# EAGLE schematic lowerboard (EAGLE 9.5.2)
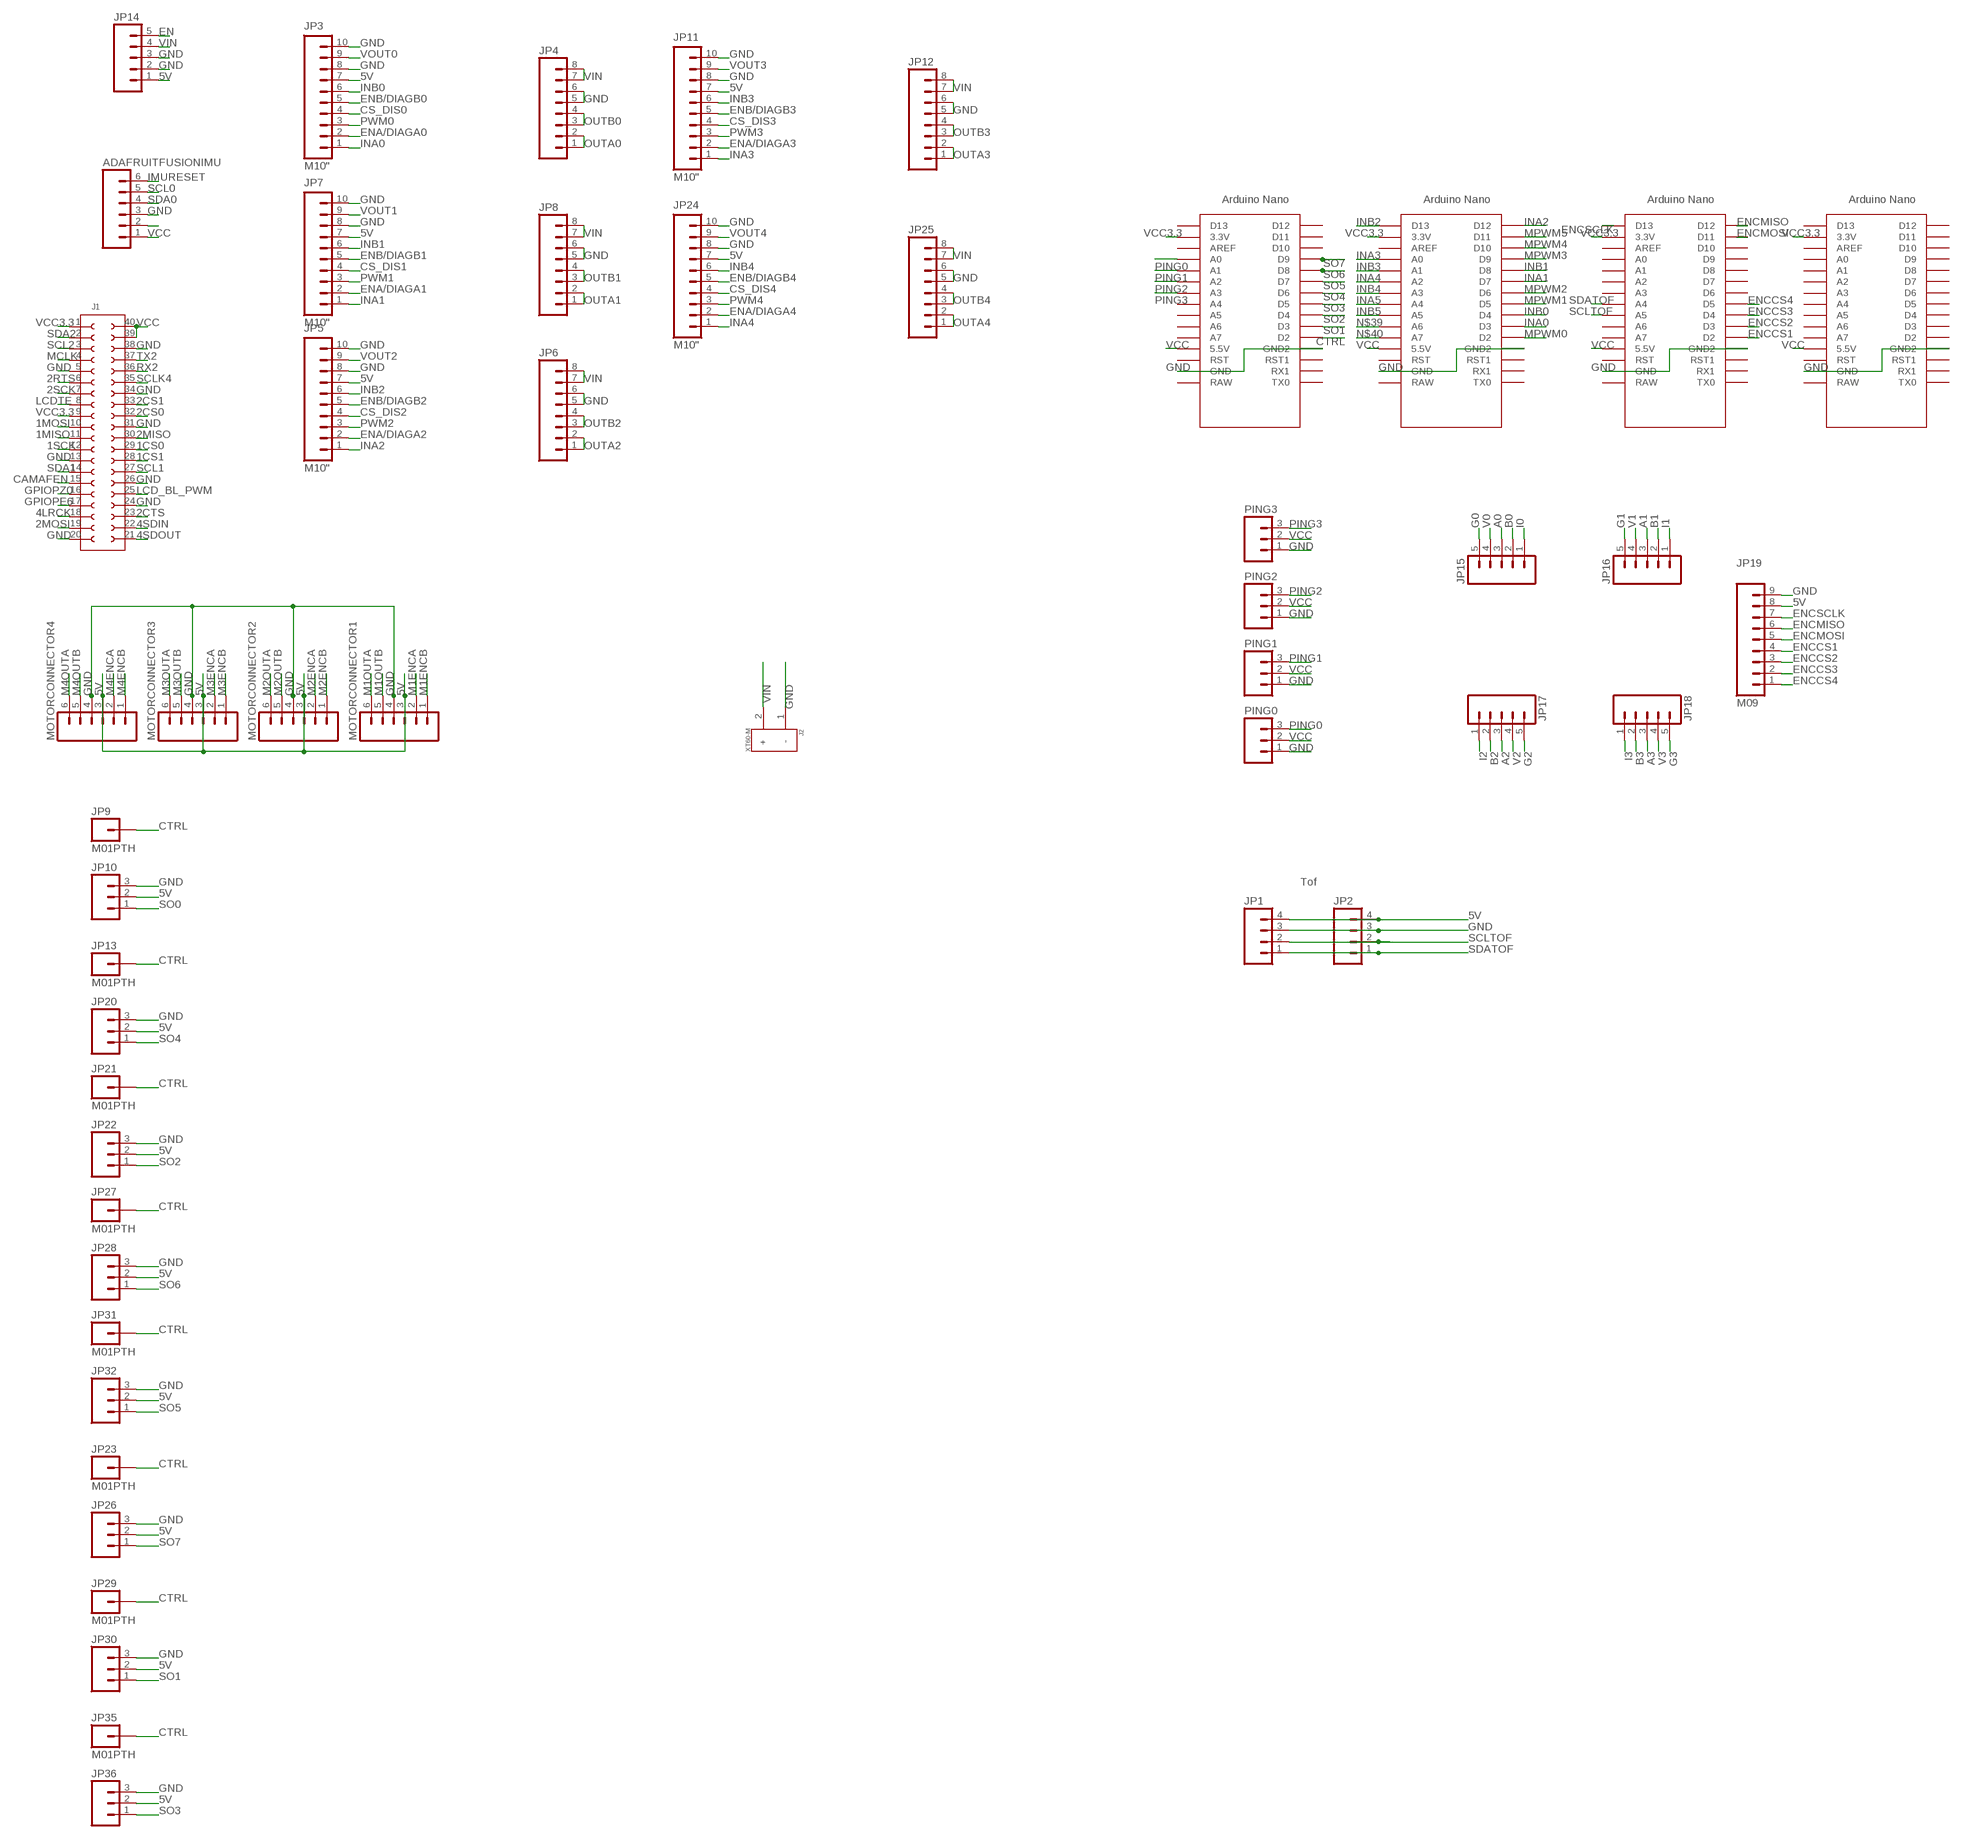
[diagram p0: schematic, sheet 1]

## Parts
ADAFRUITFUSIONIMU  M06SIP  [1X06]
J1  61304021021  [61304021021]
J2  XT60-M  [AMASS_XT60-M]
JP1  M04PTH  [1X04]
JP2  M04PTH  [1X04]
JP3  M10"  [1X10]
JP4  M08  [1X08]
JP5  M10"  [1X10]
JP6  M08  [1X08]
JP7  M10"  [1X10]
JP8  M08  [1X08]
JP9  M01PTH  [1X01]
JP10  M03PTH  [1X03]
JP11  M10"  [1X10]
JP12  M08  [1X08]
JP13  M01PTH  [1X01]
JP14  M05PTH  [1X05]
JP15  M05PTH  [1X05]
JP16  M05PTH  [1X05]
JP17  M05PTH  [1X05]
JP18  M05PTH  [1X05]
JP19  M09  [1X09]
JP20  M03PTH  [1X03]
JP21  M01PTH  [1X01]
JP22  M03PTH  [1X03]
JP23  M01PTH  [1X01]
JP24  M10"  [1X10]
JP25  M08  [1X08]
JP26  M03PTH  [1X03]
JP27  M01PTH  [1X01]
JP28  M03PTH  [1X03]
JP29  M01PTH  [1X01]
JP30  M03PTH  [1X03]
JP31  M01PTH  [1X01]
JP32  M03PTH  [1X03]
JP35  M01PTH  [1X01]
JP36  M03PTH  [1X03]
MOTORCONNECTOR1  M06LONGPADS  [1X06_LONGPADS]
MOTORCONNECTOR2  M06LONGPADS  [1X06_LONGPADS]
MOTORCONNECTOR3  M06LONGPADS  [1X06_LONGPADS]
MOTORCONNECTOR4  M06LONGPADS  [1X06_LONGPADS]
PING0  M03PTH  [1X03]
PING1  M03PTH  [1X03]
PING2  M03PTH  [1X03]
PING3  M03PTH  [1X03]
U$1  NANO  [NANO]
U$2  NANO  [NANO]
U$3  NANO  [NANO]
U$6  NANO  [NANO]

## Nets
1CS0: J1.29
1CS1: J1.28
1MISO: J1.11
1MOSI: J1.10
1SCK: J1.12
2CS0: J1.32
2CS1: J1.33
2CTS: J1.23
2MISO: J1.30
2MOSI: J1.19
2RTS: J1.6
2SCK: J1.7
4LRCK: J1.18
4SDIN: J1.22
4SDOUT: J1.21
5V: JP1.4 JP2.4 JP3.7 JP5.7 JP7.7 JP10.2 JP11.7 JP14.1 JP19.8 JP20.2 JP22.2 JP24.7 JP26.2 JP28.2 JP30.2 JP32.2 JP36.2 MOTORCONNECTOR1.3 MOTORCONNECTOR2.3 MOTORCONNECTOR3.3 MOTORCONNECTOR4.3
A0: JP15.3
A1: JP16.3
A2: JP17.3
A3: JP18.3
B0: JP15.2
B1: JP16.2
B2: JP17.2
B3: JP18.2
CAMAFEN: J1.15
CS_DIS0: JP3.4
CS_DIS1: JP7.4
CS_DIS2: JP5.4
CS_DIS3: JP11.4
CS_DIS4: JP24.4
CTRL: JP9.1 JP13.1 JP21.1 JP23.1 JP27.1 JP29.1 JP31.1 JP35.1 U$2.D2
EN: JP14.5
ENA/DIAGA0: JP3.2
ENA/DIAGA1: JP7.2
ENA/DIAGA2: JP5.2
ENA/DIAGA3: JP11.2
ENA/DIAGA4: JP24.2
ENB/DIAGB0: JP3.5
ENB/DIAGB1: JP7.5
ENB/DIAGB2: JP5.5
ENB/DIAGB3: JP11.5
ENB/DIAGB4: JP24.5
ENCCS1: JP19.4 U$1.D2
ENCCS2: JP19.3 U$1.D3
ENCCS3: JP19.2 U$1.D4
ENCCS4: JP19.1 U$1.D5
ENCMISO: JP19.6 U$1.D12
ENCMOSI: JP19.5 U$1.D11
ENCSCLK: JP19.7 U$1.D13
G0: JP15.5
G1: JP16.5
G2: JP17.5
G3: JP18.5
GND: ADAFRUITFUSIONIMU.3 J1.5 J1.13 J1.20 J1.24 J1.26 J1.31 J1.34 J1.38 J2.1(-) JP1.3 JP2.3 JP3.8 JP3.10 JP4.5 JP4.6 JP5.8 JP5.10 JP6.5 JP6.6 JP7.8 JP7.10 JP8.5 JP8.6 JP10.3 JP11.8 JP11.10 JP12.5 JP12.6 JP14.2 JP14.3 JP19.9 JP20.3 JP22.3 JP24.8 JP24.10 JP25.5 JP25.6 JP26.3 JP28.3 JP30.3 JP32.3 JP36.3 MOTORCONNECTOR1.4 MOTORCONNECTOR2.4 MOTORCONNECTOR3.4 MOTORCONNECTOR4.4 PING0.1 PING1.1 PING2.1 PING3.1 U$1.GND U$1.GND1(GND2) U$2.GND U$2.GND1(GND2) U$3.GND U$3.GND1(GND2) U$6.GND U$6.GND1(GND2)
GPIOPE6: J1.17
GPIOPZ0: J1.16
I0: JP15.1
I1: JP16.1
I2: JP17.1
I3: JP18.1
IMURESET: ADAFRUITFUSIONIMU.6
INA0: JP3.1 U$6.D3
INA1: JP7.1 U$6.D7
INA2: JP5.1 U$6.D12
INA3: JP11.1 U$6.A0
INA4: JP24.1 U$6.A2
INA5: U$6.A4
INB0: JP3.6 U$6.D4
INB1: JP7.6 U$6.D8
INB2: JP5.6 U$6.D13
INB3: JP11.6 U$6.A1
INB4: JP24.6 U$6.A3
INB5: U$6.A5
LCD_BL_PWM: J1.25
LCDTE: J1.8
M1ENCA: MOTORCONNECTOR1.2
M1ENCB: MOTORCONNECTOR1.1
M1OUTA: MOTORCONNECTOR1.6
M1OUTB: MOTORCONNECTOR1.5
M2ENCA: MOTORCONNECTOR2.2
M2ENCB: MOTORCONNECTOR2.1
M2OUTA: MOTORCONNECTOR2.6
M2OUTB: MOTORCONNECTOR2.5
M3ENCA: MOTORCONNECTOR3.2
M3ENCB: MOTORCONNECTOR3.1
M3OUTA: MOTORCONNECTOR3.6
M3OUTB: MOTORCONNECTOR3.5
M4ENCA: MOTORCONNECTOR4.2
M4ENCB: MOTORCONNECTOR4.1
M4OUTA: MOTORCONNECTOR4.6
M4OUTB: MOTORCONNECTOR4.5
MCLK: J1.4
MPWM0: U$6.D2
MPWM1: U$6.D5
MPWM2: U$6.D6
MPWM3: U$6.D9
MPWM4: U$6.D10
MPWM5: U$6.D11
N$8: ADAFRUITFUSIONIMU.2
N$39: U$6.A6
N$40: U$6.A7
OUTA0: JP4.1 JP4.2
OUTA1: JP8.1 JP8.2
OUTA2: JP6.1 JP6.2
OUTA3: JP12.1 JP12.2
OUTA4: JP25.1 JP25.2
OUTB0: JP4.3 JP4.4
OUTB1: JP8.3 JP8.4
OUTB2: JP6.3 JP6.4
OUTB3: JP12.3 JP12.4
OUTB4: JP25.3 JP25.4
PING0: PING0.3 U$2.A0
PING1: PING1.3 U$2.A1
PING2: PING2.3 U$2.A2
PING3: PING3.3 U$2.A3
PWM0: JP3.3
PWM1: JP7.3
PWM2: JP5.3
PWM3: JP11.3
PWM4: JP24.3
RX2: J1.36
SCL0: ADAFRUITFUSIONIMU.5
SCL1: J1.27
SCL2: J1.3
SCLK4: J1.35
SCLTOF: JP1.2 JP2.2 U$1.A5
SDA0: ADAFRUITFUSIONIMU.4
SDA1: J1.14
SDA2: J1.2
SDATOF: JP1.1 JP2.1 U$1.A4
SO0: JP10.1
SO1: JP30.1 U$2.D3
SO2: JP22.1 U$2.D4
SO3: JP36.1 U$2.D5
SO4: JP20.1 U$2.D6
SO5: JP32.1 U$2.D7
SO6: JP28.1 U$2.D8
SO7: JP26.1 U$2.D9
TX2: J1.37
V0: JP15.4
V1: JP16.4
V2: JP17.4
V3: JP18.4
VCC: ADAFRUITFUSIONIMU.1 J1.39 J1.40 PING0.2 PING1.2 PING2.2 PING3.2 U$1.5V(5.5V) U$2.5V(5.5V) U$3.5V(5.5V) U$6.5V(5.5V)
VCC3.3: J1.1 J1.9 U$1.3.3V U$2.3.3V U$3.3.3V U$6.3.3V
VIN: J2.2(+) JP4.7 JP4.8 JP6.7 JP6.8 JP8.7 JP8.8 JP12.7 JP12.8 JP14.4 JP25.7 JP25.8
VOUT0: JP3.9
VOUT1: JP7.9
VOUT2: JP5.9
VOUT3: JP11.9
VOUT4: JP24.9
Unconnected: U$1.A0 U$1.A1 U$1.A2 U$1.A3 U$1.A6 U$1.A7 U$1.AREF U$1.D6 U$1.D7 U$1.D8 U$1.D9 U$1.D10 U$1.ICSP1 U$1.ICSP2 U$1.ICSP3 U$1.ICSP4 U$1.ICSP5 U$1.ICSP6 U$1.RAW U$1.RST U$1.RST1 U$1.RX1 U$1.TX0 U$2.A4 U$2.A5 U$2.A6 U$2.A7 U$2.AREF U$2.D10 U$2.D11 U$2.D12 U$2.D13 U$2.ICSP1 U$2.ICSP2 U$2.ICSP3 U$2.ICSP4 U$2.ICSP5 U$2.ICSP6 U$2.RAW U$2.RST U$2.RST1 U$2.RX1 U$2.TX0 U$3.A0 U$3.A1 U$3.A2 U$3.A3 U$3.A4 U$3.A5 U$3.A6 U$3.A7 U$3.AREF U$3.D2 U$3.D3 U$3.D4 U$3.D5 U$3.D6 U$3.D7 U$3.D8 U$3.D9 U$3.D10 U$3.D11 U$3.D12 U$3.D13 U$3.ICSP1 U$3.ICSP2 U$3.ICSP3 U$3.ICSP4 U$3.ICSP5 U$3.ICSP6 U$3.RAW U$3.RST U$3.RST1 U$3.RX1 U$3.TX0 U$6.AREF U$6.ICSP1 U$6.ICSP2 U$6.ICSP3 U$6.ICSP4 U$6.ICSP5 U$6.ICSP6 U$6.RAW U$6.RST U$6.RST1 U$6.RX1 U$6.TX0

## Notes on the sheet
- Tof

## Library data of the parts
ADAFRUITFUSIONIMU MOTORCONNECTOR1-MOTORCONNECTOR4 = SparkFun:M06: Header 6 Standard 6-pin 0.1" header. Use with straight break away headers (SKU : PRT-00116), right angle break away headers (PRT-00553), swiss pins (PRT-00743), machine pins (PRT-00117), and female headers (PRT-00115). Molex polarized connector foot print use with SKU : PRT-08094 with associated crimp pins and housings. NOTES ON THE VARIANTS LOCK and LOCK_LONGPADS... This footprint was designed to help hold the alignment of a through-hole component (i.e. 6-pin header) while soldering it into place. You may notice that each hole has been shifted either up or down by 0.005 of an inch from it's more standard position (which is a perfectly straight line). This slight alteration caused the pins (the squares in the middle) to touch the edges of the holes. Because they are alternating, it causes a "brace" to hold the component in place. 0.005 has proven to be the perfect amount of "off-center" position when using our standard breakaway headers. Although looks a little odd when you look at the bare footprint, once you have a header in there, the alteration is very hard to notice. Also, if you push a header all the way into place, it is covered up entirely on the bottom side. This idea of altering the position of holes to aid alignment will be further integrated into the Sparkfun Library for other footprints. It can help hold any component with 3 or more connection pins.
J1 = Wurth_Elektronik_Electromechanic_Board_to_Board_Connectors_rev17a:61304021021: WR-PHD 2.54mm Angled Dual Pin Header, 40 Pins =>Code : Con_BTB_PHD_2.54_2_61304021021 <http://katalog.we-online.de/media/images/v2/Family_wr-phd_6130XX21021.jpg> Details see: http://katalog.we-online.de/en/em/613_0xx_210_21 Created 2014-05-29, Karrer Zheng 2014 (C) Würth Elektronik
J2 = XT60-M:XT60-M: DC supply; XT60; male; PIN:2; for cable; soldered; 60A; 500V; AVAILABILITY: Unavailable; MF: AMASS; MP: XT60-M; PACKAGE: Package Analog Devices; PRICE: None
JP1 JP2 = SparkFun:M04: Header 4 Standard 4-pin 0.1" header. Use with straight break away headers (SKU : PRT-00116), right angle break away headers (PRT-00553), swiss pins (PRT-00743), machine pins (PRT-00117), and female headers (PRT-00115). Molex polarized connector foot print use with SKU : PRT-08231 with associated crimp pins and housings.
JP3 JP5 JP7 JP11 JP24 = SparkFun:M10: Header 10 Standard 10-pin 0.1" header. Use with straight break away headers (SKU : PRT-00116), right angle break away headers (PRT-00553), swiss pins (PRT-00743), machine pins (PRT-00117), and female headers (PRT-00115).
JP4 JP6 JP8 JP12 JP25 = SparkFun:M08: Header 8 Standard 8-pin 0.1" header. Use with straight break away headers (SKU : PRT-00116), right angle break away headers (PRT-00553), swiss pins (PRT-00743), machine pins (PRT-00117), and female headers (PRT-00115).
JP9 JP13 JP21 JP23 JP27 JP29 JP31 JP35 = SparkFun:M01: Header 1 Standard 1-pin 0.1" header. Use with straight break away headers (SKU : PRT-00116), right angle break away headers (PRT-00553), swiss pins (PRT-00743), machine pins (PRT-00117), and female headers (PRT-00115).
JP10 JP20 JP22 JP26 JP28 JP30 JP32 JP36 PING0 PING1-PING3 = SparkFun:M03: Header 3 Standard 3-pin 0.1" header. Use with straight break away headers (SKU : PRT-00116), right angle break away headers (PRT-00553), swiss pins (PRT-00743), machine pins (PRT-00117), and female headers (PRT-00115). Molex polarized connector foot print use with SKU : PRT-08232 with associated crimp pins and housings.
JP14-JP18 = SparkFun:M05: Header 5 Standard 5-pin 0.1" header. Use with straight break away headers (SKU : PRT-00116), right angle break away headers (PRT-00553), swiss pins (PRT-00743), machine pins (PRT-00117), and female headers (PRT-00115). Molex polarized connector foot print use with SKU : PRT-08230 with associated crimp pins and housings.
JP19 = SparkFun:M09: Header 9 Standard 9-pin 0.1" header. Use with straight break away headers (SKU : PRT-00116), right angle break away headers (PRT-00553), swiss pins (PRT-00743), machine pins (PRT-00117), and female headers (PRT-00115).
U$1-U$3 U$6 = Arduino-clone:NANO: Arduino Nano